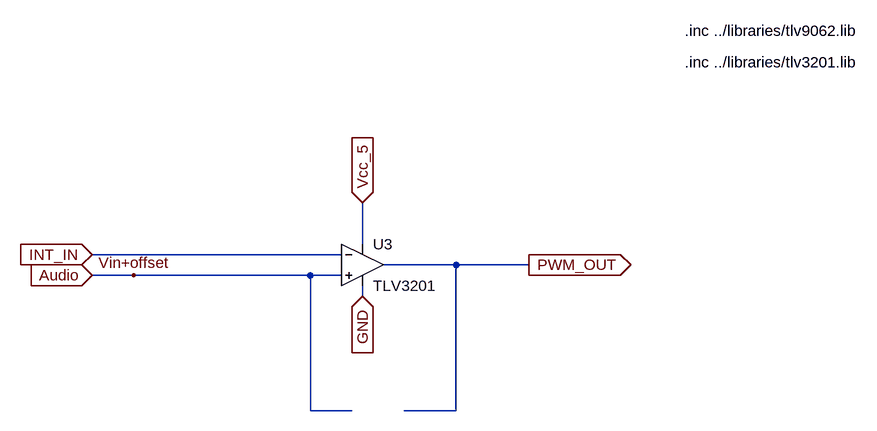
[diagram p0: schematic PWM_modulator_component.asc]
PWM_modulator_component.asc, the LTspice schematic file:
Version 4
SHEET 1 1432 836
WIRE 48 288 48 224
WIRE 16 304 -368 304
WIRE 192 320 80 320
WIRE 304 320 192 320
WIRE -304 336 -368 336
WIRE -32 336 -304 336
WIRE 16 336 -32 336
WIRE 48 368 48 352
WIRE -32 544 -32 336
WIRE 32 544 -32 544
WIRE 192 544 192 320
WIRE 192 544 112 544
FLAG 48 224 Vcc_5
IOPIN 48 224 In
FLAG -368 304 INT_IN
IOPIN -368 304 In
FLAG -368 336 Audio
IOPIN -368 336 In
FLAG 304 320 PWM_OUT
IOPIN 304 320 Out
FLAG -304 336 Vin+offset
FLAG 48 368 GND
IOPIN 48 368 In
SYMBOL OpAmps\\opamp2 48 256 R0
SYMATTR InstName U3
SYMATTR Value TLV3201
TEXT 544 -40 Left 2 !.inc ../libraries/tlv9062.lib
TEXT 544 8 Left 2 !.inc ../libraries/tlv3201.lib

The netlist it stands for:
* PWM_modulator_component.asc
XU3 Vin+offset INT_IN Vcc_5 GND PWM_OUT TLV3201  ; pins In+ In- V+ V- OUT
.inc ../libraries/tlv9062.lib
.inc ../libraries/tlv3201.lib
.backanno
.end